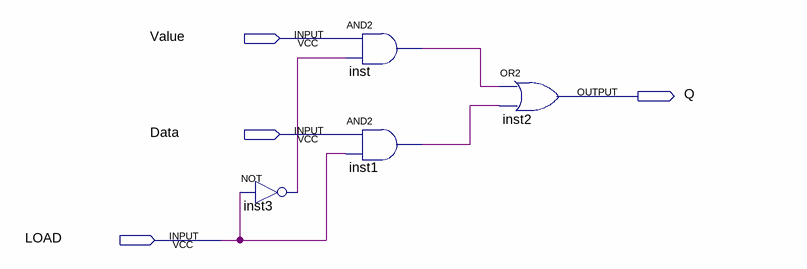
[diagram p0: schematic sheet]
// Quartus schematic MUX.bdf as structural Verilog: 4 symbols, 4 pins
module MUX (
  input  Value,
  input  Data,
  input  LOAD,
  output Q
);

  wire inst1_out, inst3_out, inst_out;

  not inst3 (inst3_out, LOAD);
  and inst (inst_out, Value, inst3_out);
  and inst1 (inst1_out, Data, LOAD);
  or inst2 (Q, inst_out, inst1_out);
endmodule
